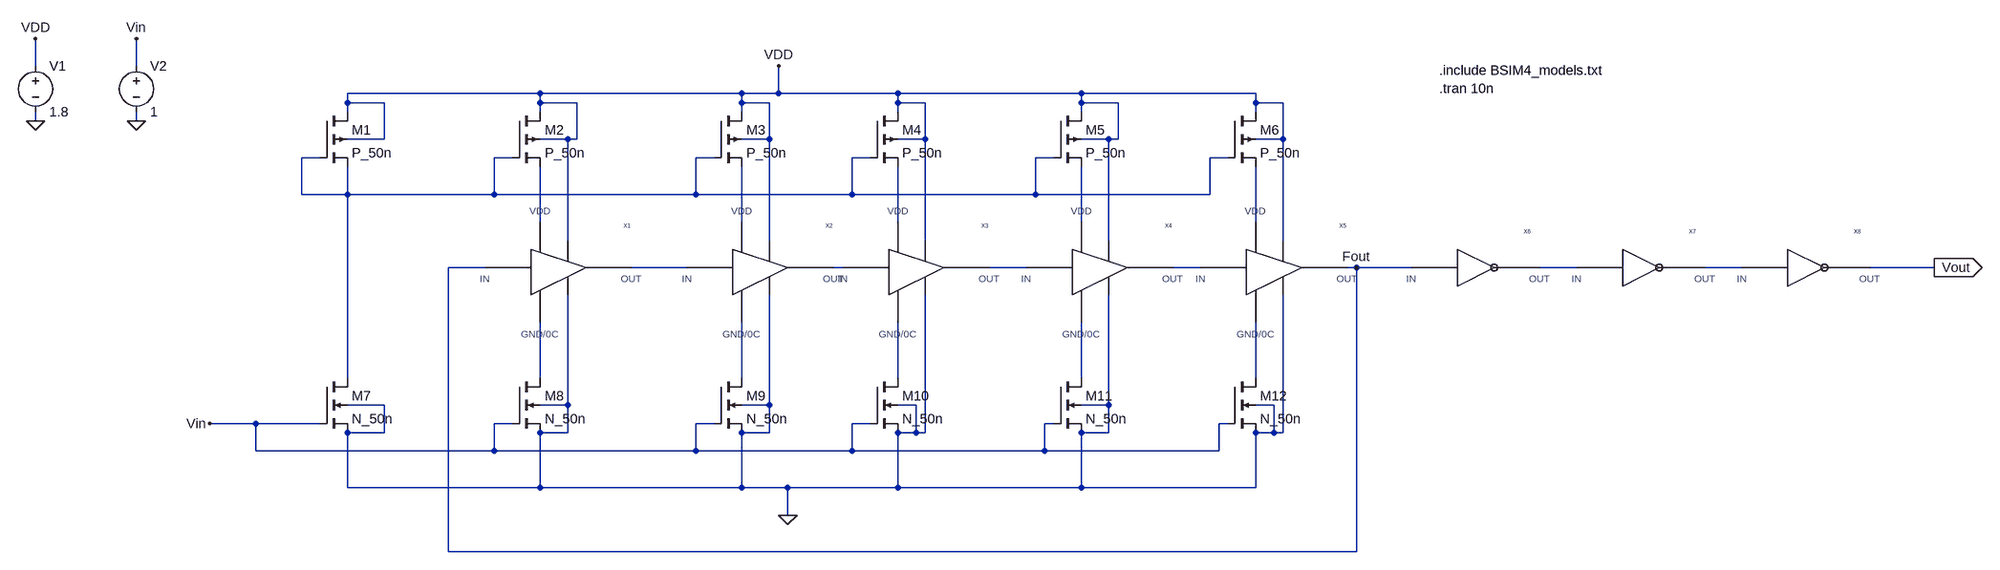
[diagram p0: schematic VCO.asc]
VCO.asc, the LTspice schematic file:
Version 4
SHEET 1 3008 772
WIRE -416 -80 -416 -128
WIRE -240 -80 -240 -128
WIRE 464 -32 128 -32
WIRE 816 -32 464 -32
WIRE 880 -32 880 -80
WIRE 880 -32 816 -32
WIRE 1088 -32 880 -32
WIRE 1408 -32 1088 -32
WIRE 1712 -32 1408 -32
WIRE 128 -16 128 -32
WIRE 192 -16 128 -16
WIRE 464 -16 464 -32
WIRE 528 -16 464 -16
WIRE 816 -16 816 -32
WIRE 864 -16 816 -16
WIRE 1088 -16 1088 -32
WIRE 1136 -16 1088 -16
WIRE 1408 -16 1408 -32
WIRE 1472 -16 1408 -16
WIRE 1712 -16 1712 -32
WIRE 1760 -16 1712 -16
WIRE 128 0 128 -16
WIRE 464 0 464 -16
WIRE 816 0 816 -16
WIRE 1088 0 1088 -16
WIRE 1408 0 1408 -16
WIRE 1712 0 1712 -16
WIRE -416 16 -416 0
WIRE -240 16 -240 0
WIRE 192 48 192 -16
WIRE 192 48 128 48
WIRE 512 48 464 48
WIRE 528 48 528 -16
WIRE 528 48 512 48
WIRE 864 48 864 -16
WIRE 864 48 816 48
WIRE 1136 48 1136 -16
WIRE 1136 48 1088 48
WIRE 1456 48 1408 48
WIRE 1472 48 1472 -16
WIRE 1472 48 1456 48
WIRE 1760 48 1760 -16
WIRE 1760 48 1712 48
WIRE 80 80 48 80
WIRE 416 80 384 80
WIRE 768 80 736 80
WIRE 1040 80 1008 80
WIRE 1360 80 1328 80
WIRE 1664 80 1632 80
WIRE 48 144 48 80
WIRE 128 144 128 96
WIRE 128 144 48 144
WIRE 384 144 384 80
WIRE 384 144 128 144
WIRE 736 144 736 80
WIRE 736 144 384 144
WIRE 1008 144 1008 80
WIRE 1008 144 736 144
WIRE 1328 144 1328 80
WIRE 1328 144 1008 144
WIRE 1632 144 1632 80
WIRE 1632 144 1328 144
WIRE 464 192 464 96
WIRE 816 192 816 96
WIRE 1088 192 1088 96
WIRE 1408 192 1408 96
WIRE 1712 192 1712 96
WIRE 512 224 512 48
WIRE 864 224 864 48
WIRE 1136 224 1136 48
WIRE 1456 224 1456 48
WIRE 1760 224 1760 48
WIRE 368 272 304 272
WIRE 720 272 624 272
WIRE 992 272 976 272
WIRE 1312 272 1248 272
WIRE 1616 272 1568 272
WIRE 1888 272 1872 272
WIRE 1984 272 1888 272
WIRE 2272 272 2208 272
WIRE 2560 272 2496 272
WIRE 2896 272 2784 272
WIRE 128 464 128 144
WIRE 464 464 464 368
WIRE 816 464 816 368
WIRE 1088 464 1088 368
WIRE 1408 464 1408 368
WIRE 1712 464 1712 368
WIRE 192 512 128 512
WIRE 512 512 512 320
WIRE 512 512 464 512
WIRE 864 512 864 320
WIRE 864 512 816 512
WIRE 1120 512 1088 512
WIRE 1456 512 1456 320
WIRE 1456 512 1408 512
WIRE 1744 512 1712 512
WIRE -32 544 -112 544
WIRE 80 544 -32 544
WIRE 416 544 384 544
WIRE 768 544 736 544
WIRE 1040 544 1008 544
WIRE 1360 544 1344 544
WIRE 1664 544 1648 544
WIRE 192 560 192 512
WIRE 192 560 128 560
WIRE 512 560 512 512
WIRE 512 560 464 560
WIRE 864 560 864 512
WIRE 864 560 816 560
WIRE 1120 560 1120 512
WIRE 1120 560 1088 560
WIRE 1136 560 1136 320
WIRE 1136 560 1120 560
WIRE 1456 560 1456 512
WIRE 1456 560 1408 560
WIRE 1744 560 1744 512
WIRE 1744 560 1712 560
WIRE 1760 560 1760 320
WIRE 1760 560 1744 560
WIRE -32 592 -32 544
WIRE 384 592 384 544
WIRE 384 592 -32 592
WIRE 736 592 736 544
WIRE 736 592 384 592
WIRE 1008 592 1008 544
WIRE 1008 592 736 592
WIRE 1344 592 1344 544
WIRE 1344 592 1008 592
WIRE 1648 592 1648 544
WIRE 1648 592 1344 592
WIRE 128 656 128 560
WIRE 464 656 464 560
WIRE 464 656 128 656
WIRE 816 656 816 560
WIRE 816 656 464 656
WIRE 896 656 816 656
WIRE 1088 656 1088 560
WIRE 1088 656 896 656
WIRE 1408 656 1408 560
WIRE 1408 656 1088 656
WIRE 1712 656 1712 560
WIRE 1712 656 1408 656
WIRE 896 704 896 656
WIRE 304 768 304 272
WIRE 1888 768 1888 272
WIRE 1888 768 304 768
FLAG -416 16 0
FLAG -240 16 0
FLAG -416 -128 VDD
FLAG -240 -128 Vin
FLAG 880 -80 VDD
FLAG -112 544 Vin
FLAG 896 704 0
FLAG 2896 272 Vout
IOPIN 2896 272 Out
FLAG 1888 272 Fout
SYMBOL pmos4 80 0 R0
SYMATTR InstName M1
SYMATTR Value P_50n
SYMBOL voltage -416 -96 R0
WINDOW 123 0 0 Left 0
WINDOW 39 0 0 Left 0
SYMATTR InstName V1
SYMATTR Value 1.8
SYMBOL voltage -240 -96 R0
WINDOW 123 0 0 Left 0
WINDOW 39 0 0 Left 0
SYMATTR InstName V2
SYMATTR Value 1
SYMBOL pmos4 416 0 R0
SYMATTR InstName M2
SYMATTR Value P_50n
SYMBOL pmos4 768 0 R0
SYMATTR InstName M3
SYMATTR Value P_50n
SYMBOL pmos4 1040 0 R0
SYMATTR InstName M4
SYMATTR Value P_50n
SYMBOL pmos4 1360 0 R0
SYMATTR InstName M5
SYMATTR Value P_50n
SYMBOL pmos4 1664 0 R0
SYMATTR InstName M6
SYMATTR Value P_50n
SYMBOL CMOS_Inv2 512 272 R0
SYMATTR InstName X1
SYMBOL CMOS_Inv2 864 272 R0
SYMATTR InstName X2
SYMBOL CMOS_Inv2 1136 272 R0
SYMATTR InstName X3
SYMBOL CMOS_Inv2 1456 272 R0
SYMATTR InstName X4
SYMBOL CMOS_Inv2 1760 272 R0
SYMATTR InstName X5
SYMBOL CMOS_Inverter 2096 272 R0
SYMATTR InstName X6
SYMBOL CMOS_Inverter 2384 272 R0
SYMATTR InstName X7
SYMBOL CMOS_Inverter 2672 272 R0
SYMATTR InstName X8
SYMBOL nmos4 80 464 R0
SYMATTR InstName M7
SYMATTR Value N_50n
SYMBOL nmos4 416 464 R0
SYMATTR InstName M8
SYMATTR Value N_50n
SYMBOL nmos4 768 464 R0
SYMATTR InstName M9
SYMATTR Value N_50n
SYMBOL nmos4 1040 464 R0
SYMATTR InstName M10
SYMATTR Value N_50n
SYMBOL nmos4 1360 464 R0
SYMATTR InstName M11
SYMATTR Value N_50n
SYMBOL nmos4 1664 464 R0
SYMATTR InstName M12
SYMATTR Value N_50n
TEXT 2032 -72 Left 2 !.include BSIM4_models.txt\n.tran 10n

The netlist it stands for:
* VCO.asc
M1 VDD N001 N001 VDD P_50n
V1 VDD 0 1.8
V2 Vin 0 1
M2 VDD N001 N002 VDD P_50n
M3 VDD N001 N003 VDD P_50n
M4 VDD N001 N004 VDD P_50n
M5 VDD N001 N005 VDD P_50n
M6 VDD N001 N006 VDD P_50n
XX1 Fout N007 N002 N013 VDD 0 CMOS_Inv2  ; pins IN OUT VDD GND/0C V1 V2
XX2 N007 N008 N003 N014 VDD 0 CMOS_Inv2  ; pins IN OUT VDD GND/0C V1 V2
XX3 N008 N009 N004 N015 VDD 0 CMOS_Inv2  ; pins IN OUT VDD GND/0C V1 V2
XX4 N009 N010 N005 N016 VDD 0 CMOS_Inv2  ; pins IN OUT VDD GND/0C V1 V2
XX5 N010 Fout N006 N017 VDD 0 CMOS_Inv2  ; pins IN OUT VDD GND/0C V1 V2
XX6 Fout N011 CMOS_Inverter  ; pins IN OUT
XX7 N011 N012 CMOS_Inverter  ; pins IN OUT
XX8 N012 Vout CMOS_Inverter  ; pins IN OUT
M7 N001 Vin 0 0 N_50n
M8 N013 Vin 0 0 N_50n
M9 N014 Vin 0 0 N_50n
M10 N015 Vin 0 0 N_50n
M11 N016 Vin 0 0 N_50n
M12 N017 Vin 0 0 N_50n
.model NMOS NMOS
.model PMOS PMOS
.lib standard.mos
.include BSIM4_models.txt
.tran 10n
.backanno
.end